# Altium schematic sheet 3.3V Regulator.SchDoc
size A4
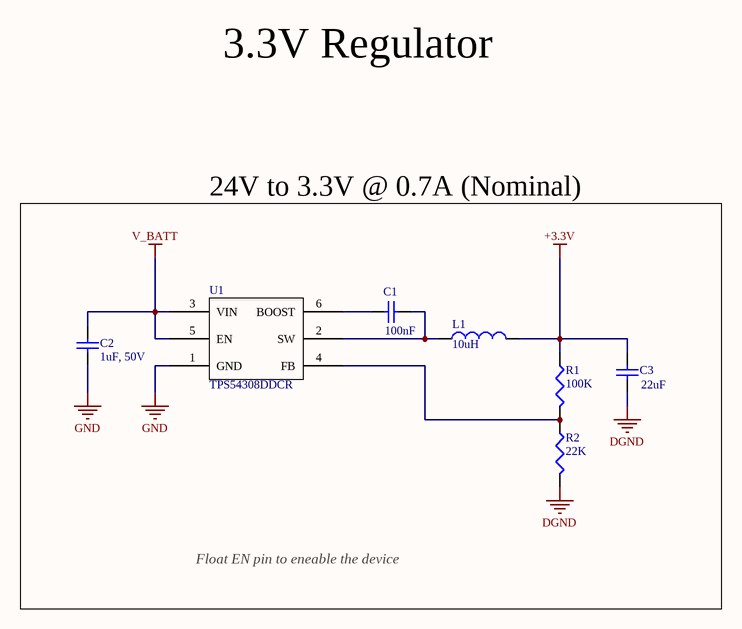
[diagram p0: 3.3V Regulator.SchDoc]

## Parts
C1  value 100nF  [CAPC2012X06N]  (hidden comment: Cap)
C2  value 1uF, 50V  [CAPC2012X06N]  (hidden comment: Cap)
C3  value 22uF  [CAPC2012X06N]  (hidden comment: Cap)
L1  value 10uH  [INDC8063X52N]  (hidden comment: Inductor)
R1  value 100K  [RES 0603 MEDIUM]  (hidden comment: Res3)
R2  value 22K  [RES 0603 MEDIUM]  (hidden comment: Res3)
U1  TPS54308DDCR  [SOT95P280X110-6N]

## Nets
+3.3V: C3.2 L1.2 R1.1
DGND: C3.1 R2.2
GND: C2.1 U1.1(GND)
V_BATT: C2.2 U1.3(VIN) U1.5(EN)
NetC1_1: C1.1 U1.6(BOOST)
NetC1_2: C1.2 L1.1 U1.2(SW)
NetR1_2: R1.2 R2.1 U1.4(FB)

## Notes on the sheet
- 3.3V Regulator
- 24V to 3.3V @ 0.7A (Nominal)
- Float EN pin to eneable the device

## Library data of the parts
C1-C3 = Cap: Capacitor; Published: 8-Jun-2000; LatestRevisionDate: 17-Jul-2002; LatestRevisionNote: Re-released for DXP Platform.; PackageReference: RAD-0.3; Publisher: Altium Limited; PackageDescription: Radial Cap, Thru-Hole; 2 Leads; 0.3 in Pin Spacing
  C1: ComponentLink1Description: 0.1uF, 50V; ComponentLink1URL: https://www.digikey.ca/product-detail/en/kemet/C0805C104M5RACTU/399-1169-1-ND/411444
  C2: ComponentLink1Description: 1uF, 50V; ComponentLink1URL: https://www.digikey.ca/product-detail/en/kemet/C0805C105K5RACTU/399-7409-1-ND/3317443
  C3: ComponentLink1Description: 22uF, 10V; ComponentLink1URL: https://www.digikey.com/product-detail/en/tdk-corporation/C2012X7S1A226M125AC/445-14560-1-ND/3956226
L1 = Inductor: PN: SRR6038-100Y                                                   10µH Shielded Wirewound Inductor 2A 38 mOhm Max Nonstandard; Code_IEC: 1005; Published: 8-Jun-2000; LatestRevisionDate: 29-May-2009; LatestRevisionNote: IPC-7351 Footprint Added.; PackageReference: 0402-A; Publisher: Altium Limited; PackageDescription: Chip Inductor; Code_JEITA: 0402; ComponentLink1Description: 10uH, 2.05A; ComponentLink1URL: https://www.digikey.com/product-detail/en/bourns-inc/SRR6038-100Y/SRR6038-100YCT-ND/2127571; ComponentLink2Description: 10uH, Better Footprint; ComponentLink2URL: https://www.digikey.ca/product-detail/en/abracon-llc/ASPIAIG-S8050-100M-T/535-13652-1-ND/6595963
R1 R2 = Res3: Resistor; Published: 8-Jun-2000; LatestRevisionDate: 29-May-2009; LatestRevisionNote: IPC-7351 Footprint Added.; PackageReference: J1-0603; Publisher: Altium Limited; PackageDescription: Chip Resistor
  R1: ComponentLink1Description: 100KOhm; ComponentLink1URL: https://www.digikey.ca/product-detail/en/vishay-dale/RCA0603100KFKEAHP/541-3247-1-ND/6561261
  R2: ComponentLink1Description: 22KOhm; ComponentLink1URL: https://www.digikey.ca/product-detail/en/vishay-dale/CRCW060322K0FKEAHP/541-22.0KSCT-ND/2825994
U1 = TPS54308DDCR: Buck Switching Regulator IC Positive Adjustable 1V 1 Output 3A SOT-23-6 Thin, TSOT-23-6